# Altium schematic sheet BOT-CPU.SchDoc: BOT-CPU-V2
size A2; Revision: 0; SheetNumber: 1; SheetTotal: 1
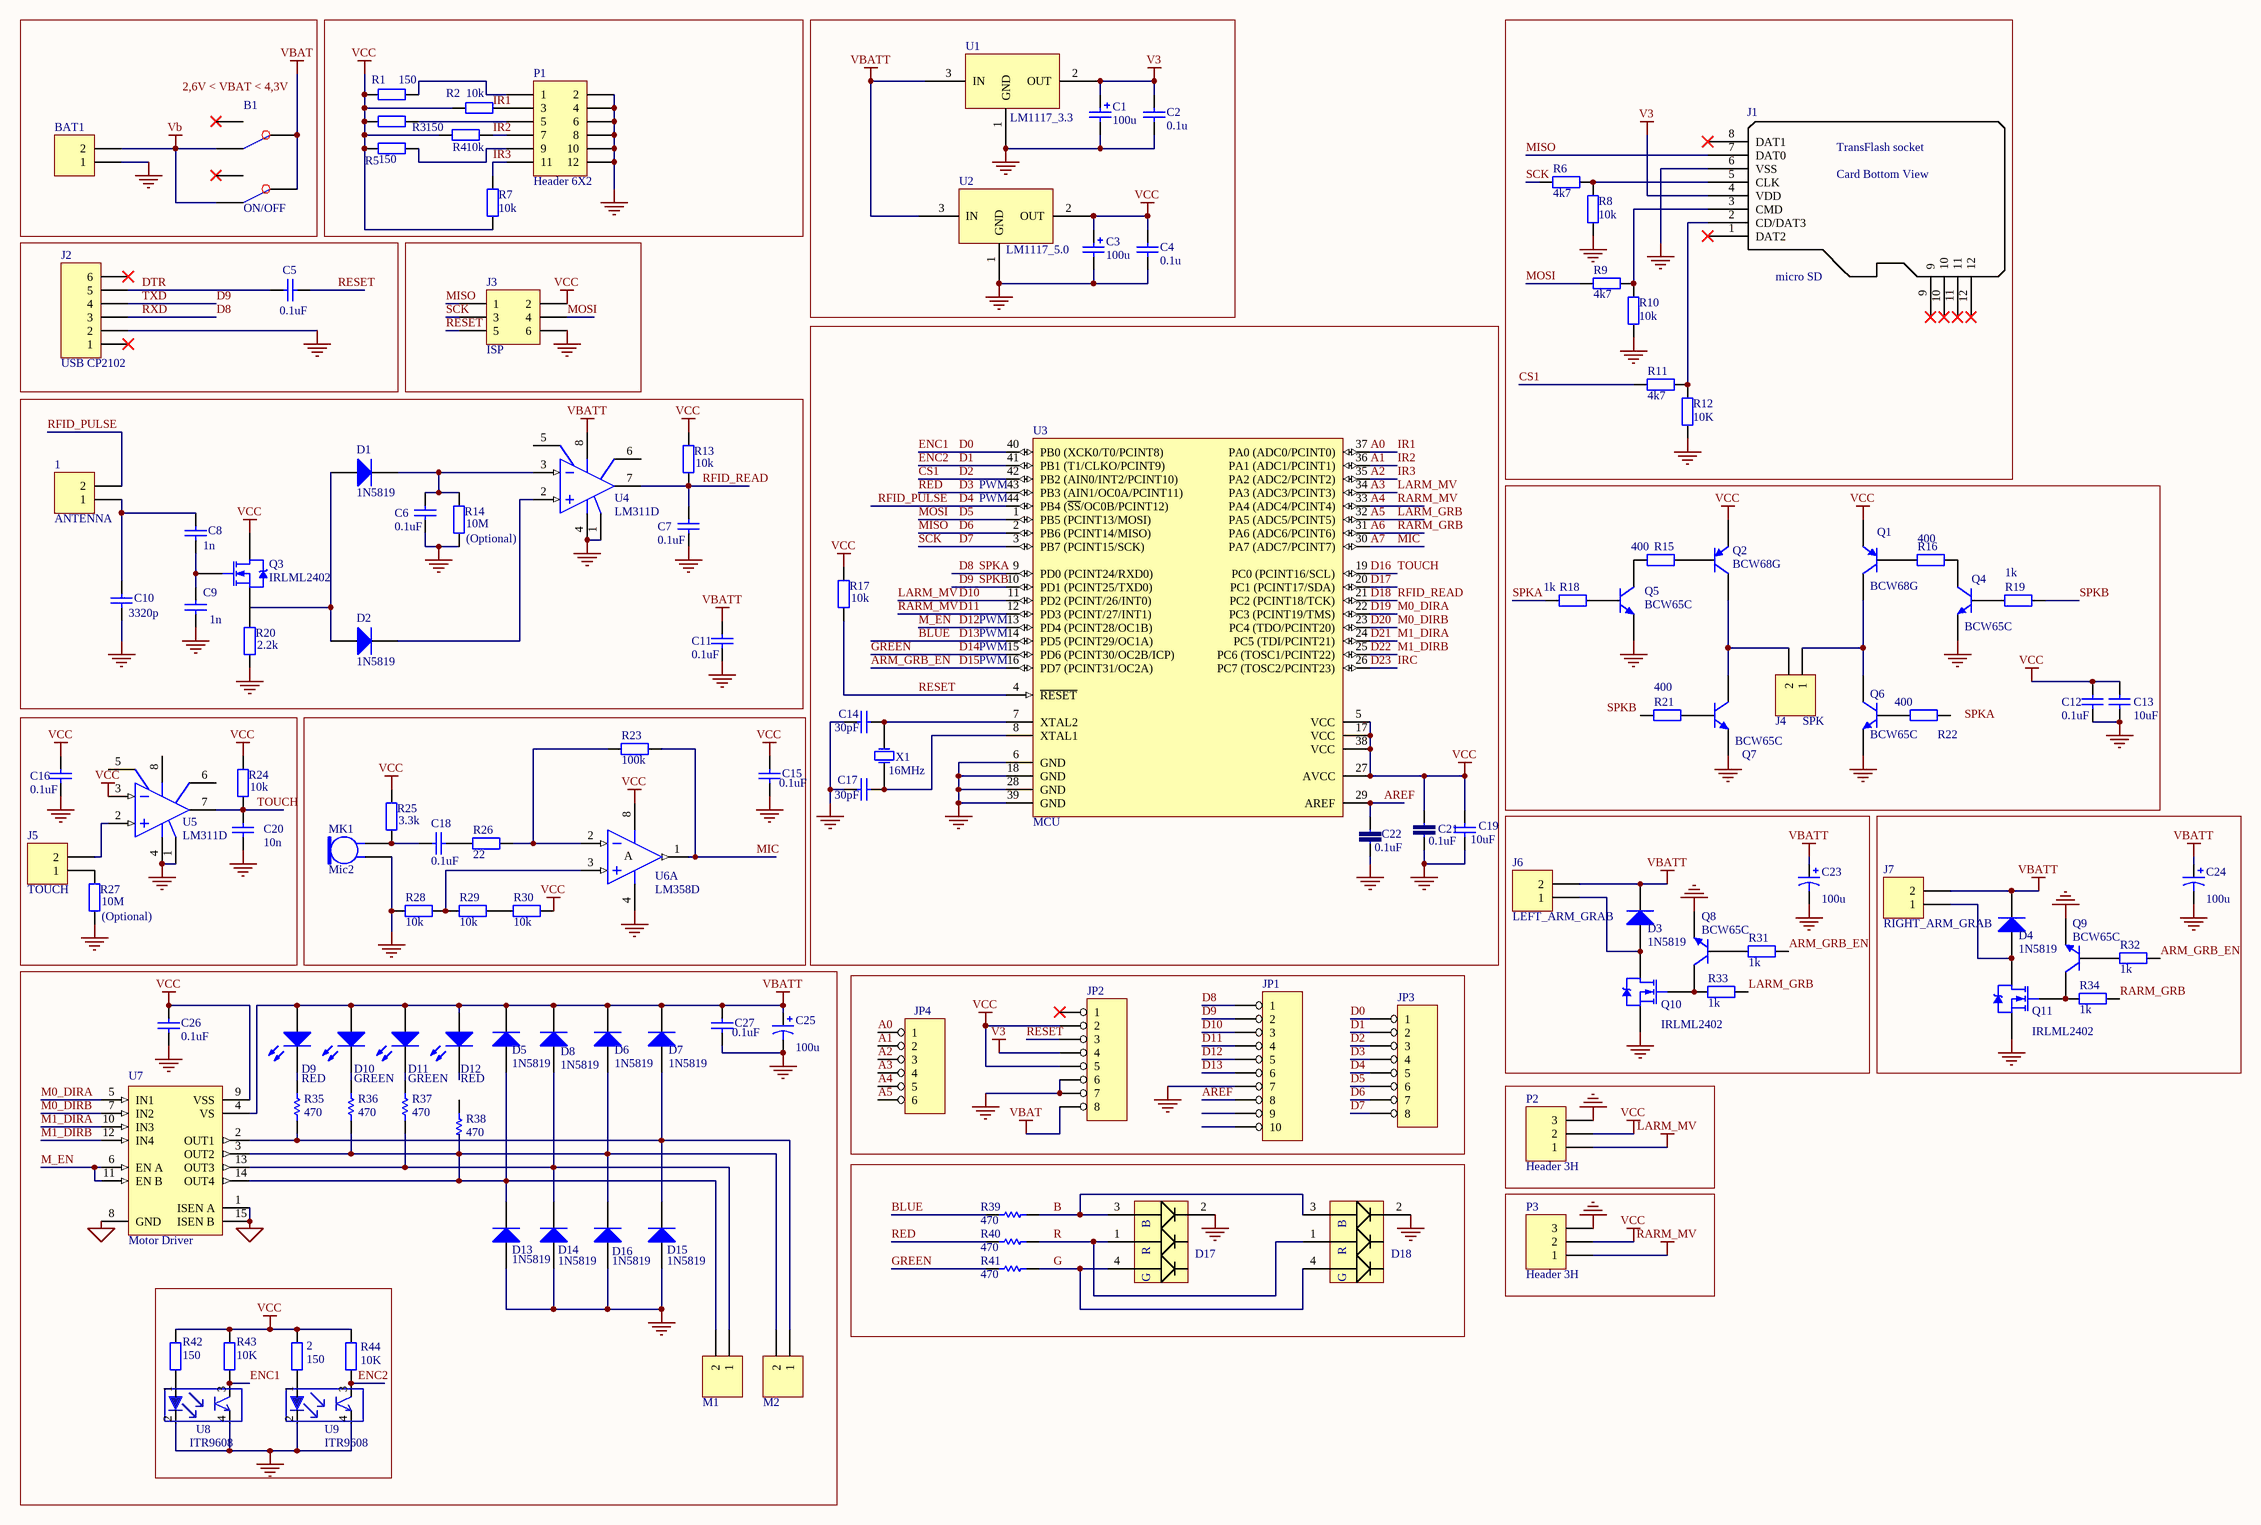
[diagram p0: BOT-CPU.SchDoc]

## Parts
1  ANTENNA  [HDR1X2]
2  value 150  [0805]  (hidden comment: 1K)
B1  ON/OFF  [KGPS22F03]
BAT1  Header 2  [CP2D2.54]  (value not drawn)
C1  100u  [C(D6.3*7)]
C2  0.1u  [0805]
C3  100u  [C(D6.3*7)]
C4  0.1u  [0805]
C5  0.1uF  [0805]
C6  0.1uF  [0805]
C7  0.1uF  [0805]
C8  value 1n  [0805]  (hidden comment: 1nF)
C9  value 1n  [0805]  (hidden comment: 1nF)
C10  value 3320p  [0805]  (hidden comment: 3320pF)
C11  0.1uF  [0805]
C12  0.1uF  [0805]
C13  10uF  [1206]
C14  30pF  [0805]
C15  0.1uF  [0805]
C16  0.1uF  [0805]
C17  30pF  [0805]
C18  0.1uF  [0805]
C19  10uF  [1206]
C20  value 10n  [0805]  (hidden comment: 0.1uF)
C21  0.1uF  [0805]
C22  0.1uF  [0805]
C23  value 100u  [C(D6.3*7)]  (hidden comment: 220u)
C24  value 100u  [C(D6.3*7)]  (hidden comment: 220u)
C25  value 100u  [C(D6.3*7)]  (hidden comment: 220u)
C26  0.1uF  [0805]
C27  0.1uF  [0805]
D1  1N5819  [4007-smt]
D2  1N5819  [4007-smt]
D3  1N5819  [4007-smt]
D4  1N5819  [4007-smt]
D5  1N5819  [4007-smt]
D6  1N5819  [4007-smt]
D7  1N5819  [4007-smt]
D8  1N5819  [4007-smt]
D9  RED  [LED-SMT]
D10  GREEN  [LED-SMT]
D11  GREEN  [LED-SMT]
D12  RED  [LED-SMT]
D13  1N5819  [4007-smt]
D14  1N5819  [4007-smt]
D15  1N5819  [4007-smt]
D16  1N5819  [4007-smt]
D17  RGB 5mm  [LED_RGB]  (value not drawn)
D18  RGB 5mm  [LED_RGB]  (value not drawn)
J1  micro SD  [MICRO_SD]
J2  USB CP2102  [SIP6]
J3  ISP  [con-6]
J4  SPK  [sip2]
J5  TOUCH  [HDR1X2]
J6  LEFT_ARM_GRAB  [HDR1X2]
J7  RIGHT_ARM_GRAB  [HDR1X2]
JP1  PADS  [ARDUINO_10*1]  (value not drawn)
JP2  PADS  [ARDUINO_8*1]  (value not drawn)
JP3  PADS  [ARDUINO_8*1]  (value not drawn)
JP4  PADS  [ARDUINO_6*1]  (value not drawn)
M1  MOLEX  [CP2D2.54]  (value not drawn)
M2  MOLEX  [CP2D2.54]  (value not drawn)
MK1  Mic2  [MIC]
P1  Header 6X2  [HDR2X6]
P2  Header 3H  [HDR1X3H]
P3  Header 3H  [HDR1X3H]
Q1  BCW68G  [SOT-23A_N]
Q2  BCW68G  [SOT-23A_N]
Q3  IRLML2402  [SOT-23_N]
Q4  BCW65C  [SOT-23A_N]
Q5  BCW65C  [SOT-23A_N]
Q6  BCW65C  [SOT-23A_N]
Q7  BCW65C  [SOT-23A_N]
Q8  BCW65C  [SOT-23A_N]
Q9  BCW65C  [SOT-23A_N]
Q10  IRLML2402  [SOT-23_N]
Q11  IRLML2402  [SOT-23_N]
R1  150  [0805]
R2  10k  [0805]
R3  150  [0805]
R4  10k  [0805]
R5  150  [0805]
R6  4k7  [0805]
R7  10k  [0805]
R8  10k  [0805]
R9  value 4k7  [0805]  (hidden comment: 10k)
R10  value 10k  [0805]  (hidden comment: 20K)
R11  value 4k7  [0805]  (hidden comment: 10k)
R12  10K  [0805]
R13  10k  [0805]
R14  (Optional)  value 10M  [0805]
R15  400  [0805]
R16  400  [0805]
R17  value 10k  [0805]  (hidden comment: 2.2k)
R18  1K  [0805]
R19  1K  [0805]
R20  2.2k  [0805]
R21  400  [0805]
R22  400  [0805]
R23  value 100k  [0805]  (hidden comment: 1M)
R24  10k  [0805]
R25  3.3k  [0805]
R26  22  [0805]
R27  (Optional)  value 10M  [0805]
R28  value 10k  [0805]
R29  value 10k  [0805]
R30  value 10k  [0805]
R31  value 1k  [0805]  (hidden comment: 2.2k)
R32  value 1k  [0805]  (hidden comment: 2.2k)
R33  value 1k  [0805]  (hidden comment: 2.2k)
R34  value 1k  [0805]  (hidden comment: 2.2k)
R35  470  [0805]
R36  470  [0805]
R37  470  [0805]
R38  470  [0805]
R39  value 470  [0805]  (hidden comment: 560)
R40  470  [0805]
R41  470  [0805]
R42  value 150  [0805]  (hidden comment: 1K)
R43  value 10K  [0805]  (hidden comment: 1K)
R44  value 10K  [0805]  (hidden comment: 1K)
U1  LM1117_3.3  [LM1117]
U2  LM1117_5.0  [LM1117]
U3  MCU  [QFP44]
U4  LM311D  [SO8_N]
U5  LM311D  [SO8_N]
U6  LM358D  [D008_L]  (part A of 2)
U7  Motor Driver  [L298N]
U8  ITR9608  [ITR9608]
U9  ITR9608  [ITR9608]
X1  16MHz  [XTAL2]

## Blocks framed on the sheet
2,6V < VBAT < 4,3V: B1 BAT1

## Nets
A3: JP1.3 JP4.4 P2.1 U3.11(PD2_(PCINT/26/INT0)) U3.34(PA3_(ADC3/PCINT3))  [also labelled D10, LARM_MV]
A4: JP1.4 JP4.5 P3.1 U3.12(PD3_(PCINT/27/INT1)) U3.33(PA4_(ADC4/PCINT4))  [also labelled D11, RARM_MV]
GND: BAT1.1 C1.2 C2.1 C3.2 C4.1 C6.1 C7.1 C9.1 C10.1 C11.1 C12.1 C13.1 C14.1 C15.2 C16.1 C17.1 C19.1 C20.1 C21.1 C22.1 C23.2 C24.2 C25.2 C26.2 C27.2 D13.1(A) D14.1(A) D15.1(A) D16.1(A) D17.2 D18.2 J1.6(VSS) J2.2 J3.6 JP1.7 JP2.6 JP2.7 MK1.2 P1.2 P1.4 P1.6 P1.8 P1.10 P1.12 P2.3 P3.3 Q4.2(E) Q5.2(E) Q6.2(E) Q7.2(E) Q8.2(E) Q9.2(E) Q10.2(S) Q11.2(S) R8.2 R10.2 R12.2 R14.2 R20.2 R27.2 R28.1 U1.1(GND) U2.1(GND) U3.6(GND) U3.18(GND) U3.28(GND) U3.39(GND) U4.1(GND) U4.4(V-_(CASE)) U5.1(GND) U5.4(V-_(CASE)) U6.4(V-) U8.2(CATHODE) U8.4(ENITIER) U9.2(CATHODE) U9.4(ENITIER)
GND_BAT: U7.1(ISEN_A) U7.8(GND) U7.15(ISEN_B)
V3: C1.1 C2.2 J1.4(VDD) JP2.4 U1.2(OUT)
Vb: B1.3 B1.4 BAT1.2
VBAT: B1.2 B1.5 JP2.8
VBATT: C11.2 C23.1 C24.1 C25.1 C27.1 D3.2(K) D4.2(K) D5.2(K) D6.2(K) D7.2(K) D8.2(K) D9.1(A) D10.1(A) D11.1(A) D12.1(A) J6.2 J7.2 U1.3(IN) U2.3(IN) U4.8(V+) U7.4(VS)
VCC: 2.2 C3.1 C4.2 C12.2 C13.2 C15.1 C16.2 C19.2 C21.2 C26.1 J3.2 JP2.2 JP2.5 P2.2 P3.2 Q1.2(E) Q2.2(E) Q3.3(D) R1.1 R2.1 R3.1 R4.1 R5.1 R7.1 R13.1 R17.1 R24.1 R25.1 R30.2 R42.2 R43.2 R44.2 U2.2(OUT) U3.5(VCC) U3.17(VCC) U3.27(AVCC) U3.38(VCC) U5.3(IN-) U6.8(V+) U7.9(VSS)
A0: JP4.1 U3.37(PA0_(ADC0/PCINT0))  [also labelled IR1]
A1: JP4.2 P1.7 R4.2 U3.36(PA1_(ADC1/PCINT1))  [also labelled IR2]
A2: JP4.3 P1.11 R7.2 U3.35(PA2_(ADC2/PCINT2))  [also labelled IR3]
A5: JP4.6 R33.2 U3.32(PA5_(ADC5/PCINT5))  [also labelled LARM_GRB]
A6: R34.2 U3.31(PA6_(ADC6/PCINT6))  [also labelled RARM_GRB]
A7: R23.2 U3.30(PA7_(ADC7/PCINT7)) U6.1(OUT)  [also labelled MIC]
AREF: C22.2 JP1.8 U3.29(AREF)
ARM_GRB_EN: R31.2 R32.2 U3.16(PD7_(PCINT31/OC2A))  [also labelled D15]
B: D17.3 D18.3 R39.2
BLUE: JP1.6 R39.1 U3.14(PD5_(PCINT29/OC1A))  [also labelled D13]
CS1: JP3.3 R11.2 U3.42(PB2_(AIN0/INT2/PCINT10))  [also labelled D2]
D0: JP3.1 R43.1 U3.40(PB0_(XCK0/T0/PCINT8)) U8.3(COLLECTOR)  [also labelled ENC1]
D1: JP3.2 R44.1 U3.41(PB1_(T1/CLKO/PCINT9)) U9.3(COLLECTOR)  [also labelled ENC2]
D3: JP3.4 R40.1 U3.43(PB3_(AIN1/OC0A/PCINT11))  [also labelled RED]
D4: 1.2 JP3.5 U3.44(PB4_(~{SS}/OC0B/PCINT12))  [also labelled RFID_PULSE]
D5: J3.4 JP3.6 R9.2 U3.1(PB5_(PCINT13/MOSI))  [also labelled MOSI]
D6: J1.7(DAT0) J3.1 JP3.7 U3.2(PB6_(PCINT14/MISO))  [also labelled MISO]
D7: J3.3 JP3.8 R6.2 U3.3(PB7_(PCINT15/SCK))  [also labelled SCK]
D8: J2.3 JP1.1 R18.1 U3.9(PD0_(PCINT24/RXD0))  [also labelled RXD, SPKA]
D9: J2.4 JP1.2 R19.1 U3.10(PD1_(PCINT25/TXD0))  [also labelled SPKB, TXD]
D12: JP1.5 U3.13(PD4_(PCINT28/OC1B)) U7.6(EN_A) U7.11(EN_B)  [also labelled M_EN]
D14: R41.1 U3.15(PD6_(PCINT30/OC2B/ICP))  [also labelled GREEN]
D16: C20.2 R24.2 U3.19(PC0_(PCINT16/SCL)) U5.7(OUT)  [also labelled TOUCH]
D17: U3.20(PC1_(PCINT17/SDA))
D18: C7.2 R13.2 U3.21(PC2_(PCINT18/TCK)) U4.7(OUT)  [also labelled RFID_READ]
D19: U3.22(PC3_(PCINT19/TMS)) U7.5(IN1)  [also labelled M0_DIRA]
D20: U3.23(PC4_(TDO/PCINT20)) U7.7(IN2)  [also labelled M0_DIRB]
D21: U3.24(PC5_(TDI/PCINT21)) U7.10(IN3)  [also labelled M1_DIRA]
D22: U3.25(PC6_(TOSC1/PCINT22)) U7.12(IN4)  [also labelled M1_DIRB]
D23: U3.26(PC7_(TOSC2/PCINT23))  [also labelled IRC]
DTR: C5.1 J2.5
G: D17.4 D18.4 R41.2
R: D17.1 D18.1 R40.2
RESET: C5.2 J3.5 JP2.3 R17.2 U3.4(~{RESET})
Net1_1: 1.1 C8.2 C10.2
Net2_1: 2.1 U9.1(ANODE)
NetC6_2: C6.2 D1.2(K) R14.1 U4.3(IN-)
NetC8_1: C8.1 C9.2 Q3.1(G)
NetC14_2: C14.2 U3.7(XTAL2) X1.2(OSC2)
NetC17_2: C17.2 U3.8(XTAL1) X1.1(OSC1)
NetC18_1: C18.1 R26.1
NetC18_2: C18.2 MK1.1 R25.2
NetD1_1: D1.1(A) D2.1(A)
NetD2_2: D2.2(K) U4.2(IN+)
NetD3_1: D3.1(A) J6.1 Q10.3(D)
NetD4_1: D4.1(A) J7.1 Q11.3(D)
NetD5_1: D5.1(A) D6.1(A) D13.2(K) D16.2(K) M1.2 M2.2 R36.1 R38.1 U7.3(OUT2) U7.14(OUT4)
NetD7_1: D7.1(A) D15.2(K) M2.1 R35.1 U7.2(OUT1)
NetD8_1: D8.1(A) D14.2(K) M1.1 R37.1 U7.13(OUT3)
NetD9_2: D9.2(K) R35.2
NetD10_2: D10.2(K) R36.2
NetD11_2: D11.2(K) R37.2
NetJ1_2: J1.2(CD/DAT3) R11.1 R12.1
NetJ1_3: J1.3(CMD) R9.1 R10.1
NetJ1_5: J1.5(CLK) R6.1 R8.1
NetJ4_1: J4.1 Q1.3(C) Q6.3(C)
NetJ4_2: J4.2 Q2.3(C) Q7.3(C)
NetJ5_1: J5.1 R27.1
NetJ5_2: J5.2 U5.2(IN+)
NetP1_1: P1.1 R1.2
NetP1_3: P1.3 R2.2
NetP1_5: P1.5 R3.2
NetP1_9: P1.9 R5.2
NetQ1_1: Q1.1(B) R16.2
NetQ2_1: Q2.1(B) R15.2
NetQ3_2: Q3.2(S) R20.1
NetQ4_3: Q4.3(C) R16.1
NetQ5_3: Q5.3(C) R15.1
NetQ8_1: Q8.1(B) R31.1
NetQ8_3: Q8.3(C) Q10.1(G) R33.1
NetQ9_1: Q9.1(B) R32.1
NetQ9_3: Q9.3(C) Q11.1(G) R34.1
NetR23_1: R23.1 R26.2 U6.2(IN-)
NetR28_2: R28.2 R29.1 U6.3(IN+)
NetR29_2: R29.2 R30.1
NetR42_1: R42.1 U8.1(ANODE)

Not connected (* = marked no-connect by the designer): B1 1* 6*; D12 2(K); J1 1(DAT2)* 8(DAT1)* 9* 10* 11* 12*; J2 1* 6*; JP1 9 10; JP2 1*; Q4 1(B); Q5 1(B); Q6 1(B); Q7 1(B); R18 2; R19 2; R21 1 2; R22 1 2; R38 2; U4 5(BAL) 6(BAL/STB); U5 5(BAL) 6(BAL/STB) 8(V+)

## Notes on the sheet
- (near U3) PWM
- Labels drawn without touching a wire or pin: IR1, SPKA, SPKB
- Title
- Size:
- Date:
- A3
- Number:
- Time:
- Revision:
- Sheet
- of
- File:
- (in symbol JJ TRANSFLASH) TransFlash socket; Card Bottom View
- (in symbol LM358D, part A) A
- (in symbol RGB PTH) B; R; G

## Library data of the parts
1 BAT1 J4-J7 M1 M2 = Header 2: Header, 2-Pin; LatestRevisionDate: 17-Jul-2002; LatestRevisionNote: Re-released for DXP Platform.; Publisher: Altium Limited
2 R1-R5 R7 R9-R11 R13-R34 R42-R44 = Res2: Resistor; Published: 8-Jun-2000; LatestRevisionDate: 17-Jul-2002; LatestRevisionNote: Re-released for DXP Platform.; PackageReference: AXIAL-0.4; Publisher: Altium Limited
  R1 R3 R5: Value: 150
  R2 R4 R7 R13 R24: Value: 10k
  R15 R16 R21 R22: Value: 400
  R18 R19: Value: 1k
  R20: Value: 2.2k
  R25: Value: 3.3k
  R26: Value: 22
B1 = Component_1
C1 C3 = Cap Pol2: Polarized Capacitor (Axial); Published: 8-Jun-2000; LatestRevisionDate: 17-Jul-2002; LatestRevisionNote: Re-released for DXP Platform.; PackageReference: POLAR0.8; Publisher: Altium Limited
C2 C4-C13 C15 C16 C18-C20 C26 C27 = Cap: Capacitor
  C2 C4: Published: 8-Jun-2000; LatestRevisionDate: 17-Jul-2002; LatestRevisionNote: Re-released for DXP Platform.; PackageReference: RAD-0.3; Publisher: Altium Limited; Value: 0.1u
  C5: Published: *; LatestRevisionDate: *; LatestRevisionNote: *; PackageReference: *; Publisher: *; Value: *
  C6 C7 C11 C12 C16 C18 C26: Published: 8-Jun-2000; LatestRevisionDate: 17-Jul-2002; LatestRevisionNote: Re-released for DXP Platform.; PackageReference: RAD-0.3; Publisher: Altium Limited; PackageDescription: Radial Cap, Thru-Hole; 2 Leads; 0.3 in Pin Spacing; Value: 0.1uF
  C8-C10: Published: 8-Jun-2000; LatestRevisionDate: 17-Jul-2002; LatestRevisionNote: Re-released for DXP Platform.; PackageReference: RAD-0.3; Publisher: Altium Limited
  C13 C19: Published: 8-Jun-2000; LatestRevisionDate: 17-Jul-2002; LatestRevisionNote: Re-released for DXP Platform.; PackageReference: RAD-0.3; Publisher: Altium Limited; PackageDescription: Radial Cap, Thru-Hole; 2 Leads; 0.3 in Pin Spacing; Value: 10uF
  C15 C20 C27: Published: 8-Jun-2000; LatestRevisionDate: 17-Jul-2002; LatestRevisionNote: Re-released for DXP Platform.; PackageReference: RAD-0.3; Publisher: Altium Limited; PackageDescription: Radial Cap, Thru-Hole; 2 Leads; 0.3 in Pin Spacing
C14 C17 = Cap: Capacitor; Value: 30P; Published: 8-Jun-2000; LatestRevisionDate: 17-Jul-2002; LatestRevisionNote: Re-released for DXP Platform.; PackageReference: RAD-0.3; Publisher: Altium Limited
C21 C22 = CAP0402: Value: 0.1uF
C23-C25 = Cap Pol1: Polarized Capacitor (Radial); Published: 8-Jun-2000; LatestRevisionDate: 17-Jul-2002; LatestRevisionNote: Re-released for DXP Platform.; PackageReference: RB7.6-15; Publisher: Altium Limited
D1-D8 D13-D16 = Diode: Default Diode
  D1-D7 D13-D16: Published: 8-Jun-2000; LatestRevisionDate: 17-Jul-2002; LatestRevisionNote: Re-released for DXP Platform.; PackageVersion: Sep-1996; PackageReference: SMC; Publisher: Altium Limited; PackageDescription: DO-214-AB/SMC; 2 C-Bend Leads; Body 7.9 x 5.9 mm, inc. leads (LxW); Code_JEDEC: DO-214-AB
  D8: Published: *; LatestRevisionDate: *; LatestRevisionNote: *; PackageVersion: *; PackageReference: *; Publisher: *; PackageDescription: *; Code_JEDEC: *
D9-D12 = LED0: Typical INFRARED GaAs LED; Published: 8-Jun-2000; LatestRevisionDate: 08-Jul-2005; LatestRevisionNote: Mech Layer 1 removed.; PackageReference: LED-0; Publisher: Altium Limited; PackageDescription: LED; 2 Leads
D17 D18 = RGB PTH
J1 = JJ TRANSFLASH: Transflash Socket
J2 = Header 6: Header, 6-Pin; LatestRevisionDate: 17-Jul-2002; LatestRevisionNote: Re-released for DXP Platform.; Publisher: Altium Limited
J3 = Header 3X2: Header, 3-Pin, Dual row; LatestRevisionDate: 17-Jul-2002; LatestRevisionNote: Re-released for DXP Platform.; Publisher: Altium Limited
JP1 = HEADER 10
JP2 JP3 = 8 HEADER: 8 Pin Header
JP4 = HEADER 6
MK1 = Mic2: Microphone; Published: *; LatestRevisionDate: *; LatestRevisionNote: *; PackageReference: *; Publisher: *
P1 = Header 6X2: Header, 6-Pin, Dual row; LatestRevisionDate: 17-Jul-2002; LatestRevisionNote: Re-released for DXP Platform.; Publisher: Altium Limited
P2 P3 = Header 3H: Header, 3-Pin, Right Angle; LatestRevisionDate: 17-Jul-2002; LatestRevisionNote: Re-released for DXP Platform.; Publisher: Altium Limited
Q1 Q2 = BCW68G: PNP General Purpose Amplifier; Published: 8-Jun-2000; LatestRevisionDate: 20-Nov-2009; LatestRevisionNote: IPC-7351 Footprint Added.; DatasheetVersion: 1997; PackageVersion: Sep-1998; PackageReference: SOT-23A; Publisher: Altium Limited; PackageDescription: 3-Pin SOT-23 Package 0.95 mm Pitch, 2.3 mm Lead Span; ComponentLink1Description: Manufacturer Link; ComponentLink1URL: http://www.fairchildsemi.com/; ComponentLink2Description: Datasheet; ComponentLink2URL: http://www.fairchildsemi.com/ds/BC%2FBCW68G.pdf
Q3 Q10 Q11 = IRLML2402: HEXFET Power MOSFET; Published: 8-Jun-2000; LatestRevisionDate: 20-Nov-2009; LatestRevisionNote: IPC-7351 Footprint Added.; DatasheetVersion: Aug-1997; PackageReference: SOT-23; Publisher: Altium Limited; PackageDescription: 3-Pin SOT-23 Package 0.95 mm Pitch, 2.3 mm Lead Span; ComponentLink1Description: Manufacturer Link; ComponentLink1URL: http://www.irf.com/; ComponentLink2Description: Datasheet; ComponentLink2URL: http://www.irf.com/product-info/datasheets/data/irlml2402.pdf
Q4-Q9 = BCW65C: NPN General Purpose Amplifier; Published: 8-Jun-2000; LatestRevisionDate: 20-Nov-2009; LatestRevisionNote: IPC-7351 Footprint Added.; DatasheetVersion: 1997; PackageVersion: Sep-1998; PackageReference: SOT-23A; Publisher: Altium Limited; PackageDescription: 3-Pin SOT-23 Package 0.95 mm Pitch, 2.3 mm Lead Span; ComponentLink1Description: Manufacturer Link; ComponentLink1URL: http://www.fairchildsemi.com/; ComponentLink2Description: Discontinuation Notice; ComponentLink2URL: http://www.fairchildsemi.com/obsolete/obs.jsp
R6 = Res2: Resistor; Value: 10k; Published: 8-Jun-2000; LatestRevisionDate: 17-Jul-2002; LatestRevisionNote: Re-released for DXP Platform.; PackageReference: AXIAL-0.4; Publisher: Altium Limited
R8 R12 = Res2: Resistor; Value: 20k; Published: 8-Jun-2000; LatestRevisionDate: 17-Jul-2002; LatestRevisionNote: Re-released for DXP Platform.; PackageReference: AXIAL-0.4; Publisher: Altium Limited
R35-R41 = Res1: Resistor; Published: 8-Jun-2000; LatestRevisionDate: 17-Jul-2002; LatestRevisionNote: Re-released for DXP Platform.; PackageReference: AXIAL-0.3; Publisher: Altium Limited; PackageDescription: Axial Device, Thru-Hole; 2 Leads; 0.3 in Pin Spacing
  R35-R38 R40 R41: Value: 470
U1 U2 = LM1117
U3 = ATmega644-20AU: 8-bit AVR Microcontroller, 2.7-5.5V, 20MHz, 64KB Flash, 2KB EEPROM, 4KB SRAM, 44-pin TQFP; DatasheetVersion: revN, Jul-2010; PackageVersion: revC, Oct-2010; PackageReference: 44A; PackageDescription: 44-Pin Plastic Thin Profile Quad Flat Pack, 10 x 10 x 1.0 mm Body, 0.8 mm Pitch (TQFP); Code_JEDEC: MS-026-ACB; ComponentLink1Description: Manufacturer URL; ComponentLink1URL: http://www.atmel.com/; ComponentLink2Description: ATmega644 Datasheet; ComponentLink2URL: http://www.atmel.com/dyn/resources/prod_documents/doc2593.pdf; ComponentLink3Description: ATmega644 Summary; ComponentLink3URL: http://www.atmel.com/dyn/resources/prod_documents/2593S.pdf
U4 U5 = LM311D: Voltage Comparator; Published: 24-Aug-2001; LatestRevisionDate: 13-Apr-2006; LatestRevisionNote: IPC-7351 Footprint Added.; DatasheetVersion: Oct-1997; PackageVersion: Dec-2002; PackageReference: SO8; Publisher: Altium Limited; PackageDescription: 8-Pin Small Outline Integrated Circuit 1.27 mm Pitch; Code_JEDEC: MS-012-AA; Code_IPC: SOIC127P600-8; ComponentLink1Description: Manufacturer Link; ComponentLink1URL: http://www.st.com/; ComponentLink2Description: Datasheet; ComponentLink2URL: http://www.st.com/stonline/products/literature/ds/4848/lm211.pdf
U6 = LM358D: Dual Operational Amplifier; Published: 16-Jan-2001; LatestRevisionDate: 13-Apr-2006; LatestRevisionNote: IPC-7351 Footprint Added.; DatasheetVersion: Jul-1998; PackageVersion: Jan-1998; PackageReference: D008; Publisher: Altium Limited; PackageDescription: 8-Pin Small Outline Integrated Circuit 1.27 mm Pitch; Code_IPC: SOIC127P600-8; ComponentLink1Description: Manufacturer Link; ComponentLink1URL: http://www.ti.com/; ComponentLink2Description: Datasheet; ComponentLink2URL: http://www-s.ti.com/sc/ds/lm358.pdf
U7 = L298N: Dual Full Bridge Driver; Published: 8-Jun-2000; LatestRevisionDate: 14-May-2007; LatestRevisionNote: Mapped to vertical PCB.; DatasheetVersion: Jul-1999; PackageReference: Multiwatt15V; Publisher: Altium Limited; PackageDescription: TO, Thru-Hole, Vertical, Heatsink Mounted; 15 Bent Staggered Leads; Pitch 1.27 mm; ComponentLink1Description: Manufacturer Link; ComponentLink1URL: http://www.st.com/; ComponentLink2Description: Datasheet; ComponentLink2URL: http://www.st.com/stonline/products/literature/ds/1773/l298.pdf
X1 = XTAL: Crystal Oscillator; Published: 8-Jun-2000; LatestRevisionDate: 17-Jul-2002; LatestRevisionNote: Re-released for DXP Platform.; PackageReference: R38; Publisher: Altium Limited